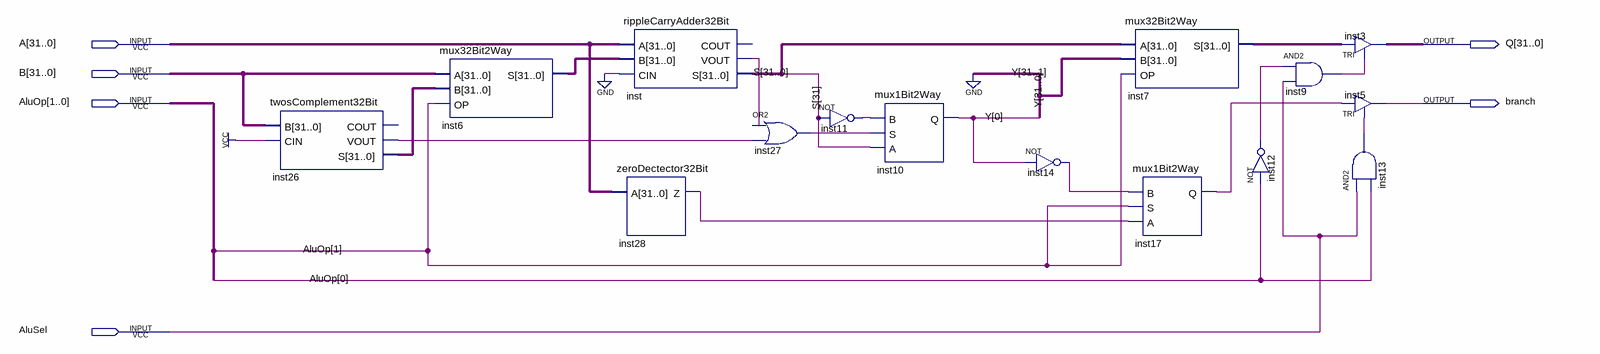
[diagram p0: schematic sheet]
// Quartus schematic aluProject.bdf as structural Verilog: 15 symbols, 6 pins
module aluProject (
  input  [31:0] A,
  input  [31:0] B,
  input  [1:0] AluOp,
  input  AluSel,
  output [31:0] Q,
  output branch
);

  wire inst9_out, inst11_out, inst12_out, inst13_out, inst14_out, inst17_q, inst26_vout, inst27_out,
       inst28_z, inst_vout;
  wire [0:0] Y;
  wire [31:0] inst6_s, inst7_s, inst26_s, S;

  twosComplement32Bit inst26 (.B(B), .CIN(1'b1), .VOUT(inst26_vout), .S(inst26_s));  // open: COUT
  mux32Bit2Way inst6 (.A(B), .B(inst26_s), .OP(AluOp[1]), .S(inst6_s));
  rippleCarryAdder32Bit inst (.A(A), .B(inst6_s), .CIN(1'b0), .VOUT(inst_vout), .S(S));  // open: COUT
  zeroDectector32Bit inst28 (.A(A), .Z(inst28_z));
  or inst27 (inst27_out, inst_vout, inst26_vout);
  mux1Bit2Way inst10 (.B(inst11_out), .S(inst27_out), .A(S[31]), .Q(Y[0]));
  not inst11 (inst11_out, S[31]);
  not inst14 (inst14_out, Y[0]);
  mux32Bit2Way inst7 (.A(S), .B({{31{1'b0}}, Y[0]}), .OP(AluOp[1]), .S(inst7_s));
  mux1Bit2Way inst17 (.B(inst14_out), .S(AluOp[1]), .A(inst28_z), .Q(inst17_q));
  and inst9 (inst9_out, inst12_out, AluSel);
  not inst12 (inst12_out, AluOp[0]);
  TRI inst3[31:0] (.IN(inst7_s), .OE(inst9_out), .OUT(Q));
  TRI inst5 (.IN(inst17_q), .OE(inst13_out), .OUT(branch));
  and inst13 (inst13_out, AluSel, AluOp[0]);
endmodule
